# Altium schematic sheet sd_card.SchDoc
size A4; SheetNumber: 13; SheetTotal: 13
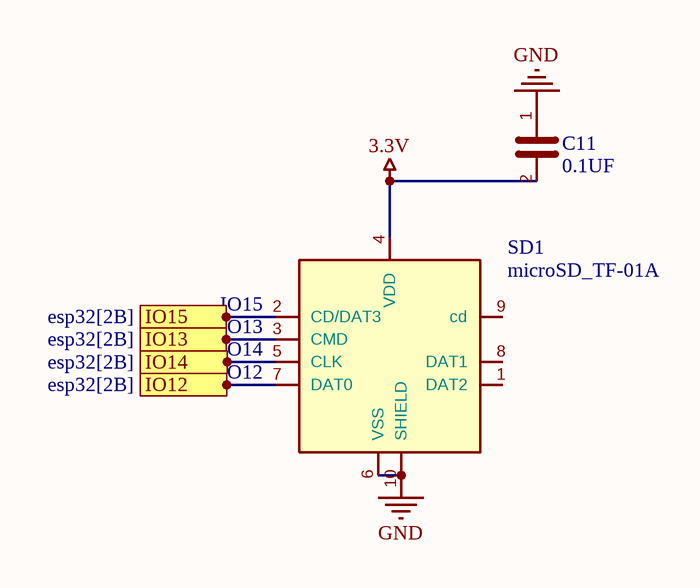
[diagram p0: sd_card.SchDoc]

## Parts
C11  0.1UF  [CAPC2013X70X45NL10T25]
SD1  microSD_TF-01A  [TF-01A]

## Ports
IO12 (see esp32[2B]), IO13 (see esp32[2B]), IO14 (see esp32[2B]), IO15 (see esp32[2B])

## Nets
3.3V: C11.2 SD1.4(VDD)
GND: C11.1 SD1.6(VSS) SD1.10(SHIELD)
IO12: SD1.7(DAT0) ; port IO12
IO13: SD1.3(CMD) ; port IO13
IO14: SD1.5(CLK) ; port IO14
IO15: SD1.2(CD/DAT3) ; port IO15

Not connected (* = marked no-connect by the designer): SD1 1(DAT2) 8(DAT1) 9(cd)

## Notes on the sheet
- (near SD1) IO15
- (near SD1) IO13
- (near SD1) IO14
- (near SD1) IO12

## Library data of the parts
C11 = C